# Altium schematic sheet devices.SchDoc
size A4
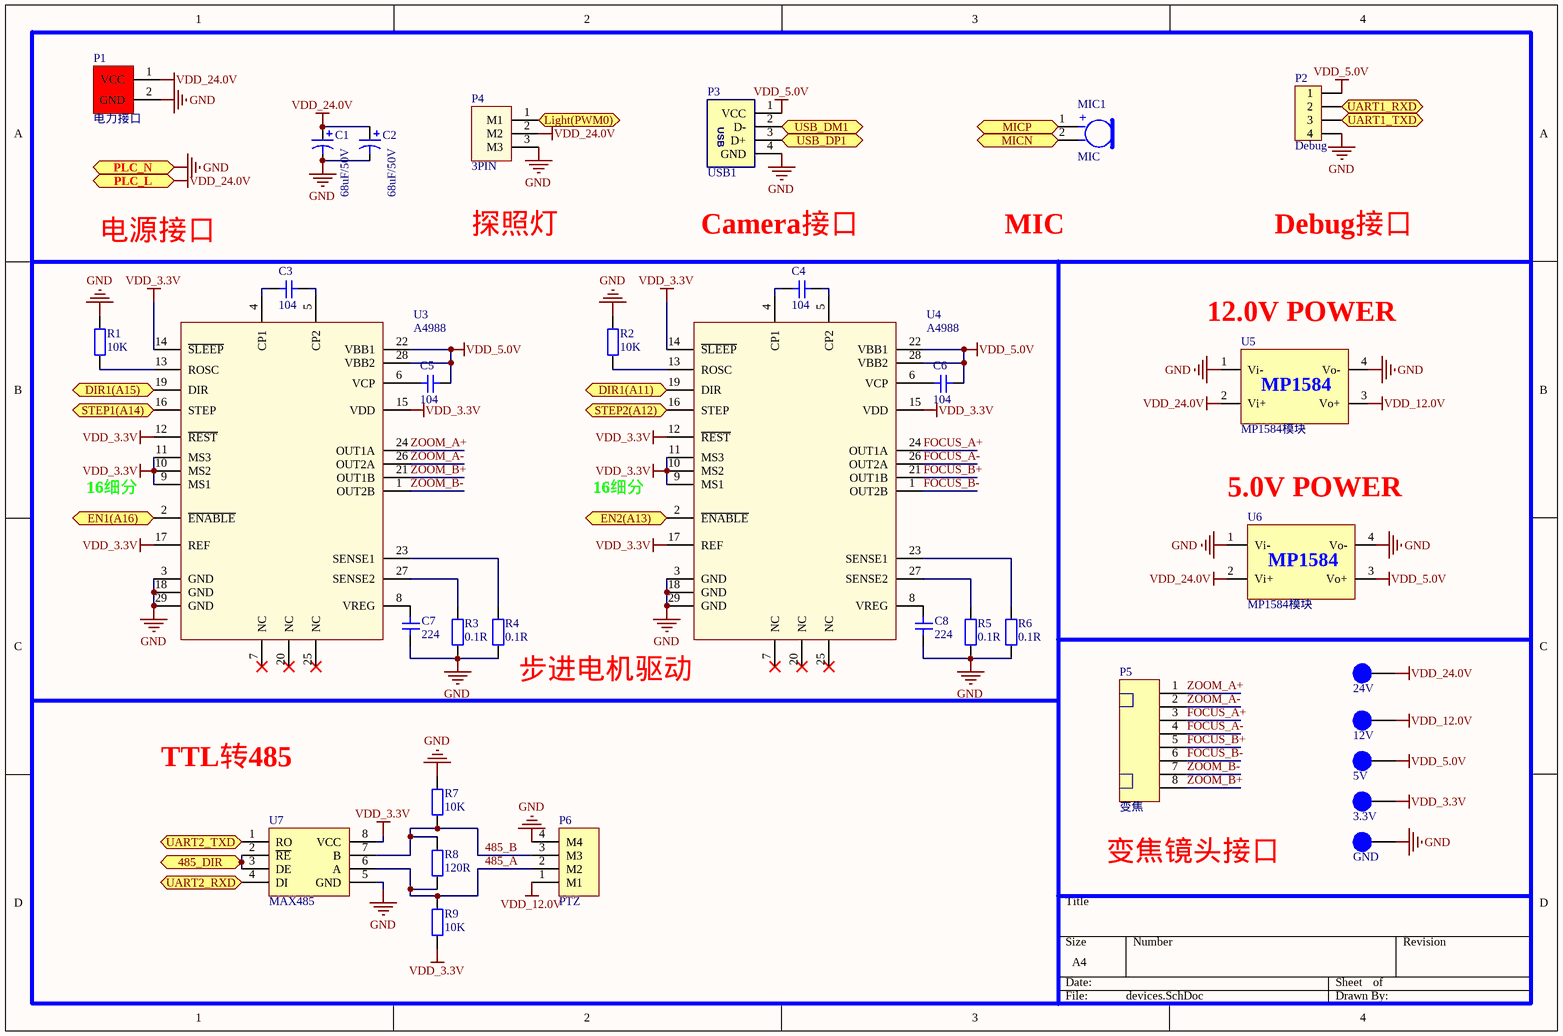
[diagram p0: devices.SchDoc]

## Parts
C1  68uF/50V  [RB.1.2]
C2  68uF/50V  [RB.1.2]
C3  104  [0603C]
C4  104  [0603C]
C5  104  [0603C]
C6  104  [0603C]
C7  224  [0603C]
C8  224  [0603C]
MIC1  MIC  [MIC]
P1  电力接口  [PH2.0WS-2P]
P2  Debug  [MX1.25WS-4PIN]
P3  USB1  [PH2.0WS-4P]
P4  3PIN  [PH2.0WS-3P]
P5  变焦  [MX1.25WS-8P]
P6  PTZ  [PH2.0WS-4P]
R1  10K  [0603R]
R2  10K  [0603R]
R3  0.1R  [0805R]
R4  0.1R  [0805R]
R5  0.1R  [0805R]
R6  0.1R  [0805R]
R7  10K  [0603R]
R8  120R  [0603R]
R9  10K  [0603R]
T1  24V  [PIN 1(贴片)]
T2  12V  [PIN 1(贴片)]
T3  5V  [PIN 1(贴片)]
T4  3.3V  [PIN 1(贴片)]
T5  GND  [PIN 1(贴片)]
U3  A4988  [QFN-28]
U4  A4988  [QFN-28]
U5  MP1584模块  [MP1584电源模块]
U6  MP1584模块  [MP1584电源模块]
U7  MAX485  [SOP-8]

## Ports
485_DIR, DIR1(A11), DIR1(A15), EN1(A16), EN2(A13), Light(PWM0), MICN, MICP, PLC_L, PLC_N, STEP1(A14), STEP2(A12), UART1_RXD, UART1_TXD, UART2_RXD, UART2_TXD, USB_DM1, USB_DP1

## Nets
GND: C1.2 C2.2 C7.1 C8.1 P1.2(GND) P2.4 P3.4(GND) P4.3(M3) P6.4(M4) R1.1 R2.1 R3.1 R4.1 R5.1 R6.1 R7.2 T5.1 U3.3(GND) U3.18(GND) U3.29(GND) U4.3(GND) U4.18(GND) U4.29(GND) U5.1(Vi-) U5.4(Vo-) U6.1(Vi-) U6.4(Vo-) U7.5(GND) ; port PLC_N
VDD_3.3V: R9.1 T4.1 U3.9(MS1) U3.10(MS2) U3.11(MS3) U3.12(~{REST}) U3.14(~{SLEEP}) U3.15(VDD) U3.17(REF) U4.9(MS1) U4.10(MS2) U4.11(MS3) U4.12(~{REST}) U4.14(~{SLEEP}) U4.15(VDD) U4.17(REF) U7.8(VCC)
VDD_5.0V: C5.2 C6.2 P2.1 P3.1(VCC) T3.1 U3.22(VBB1) U3.28(VBB2) U4.22(VBB1) U4.28(VBB2) U6.3(Vo+)
VDD_12.0V: P6.1(M1) T2.1 U5.3(Vo+)
VDD_24.0V: C1.1 C2.1 P1.1(VCC) P4.2(M2) T1.1 U5.2(Vi+) U6.2(Vi+) ; port PLC_L
485_A: P6.2(M2) R8.1 R9.2 U7.6(A)
485_B: P6.3(M3) R7.1 R8.2 U7.7(B)
485_DIR: U7.2(~{RE}) U7.3(DE) ; port 485_DIR
DIR1(A11): U4.19(DIR) ; port DIR1(A11)
DIR1(A15): U3.19(DIR) ; port DIR1(A15)
EN1(A16): U3.2(~{ENABLE}) ; port EN1(A16)
EN2(A13): U4.2(~{ENABLE}) ; port EN2(A13)
FOCUS_A+: P5.3 U4.24(OUT1A)
FOCUS_A-: P5.4 U4.26(OUT2A)
FOCUS_B+: P5.5 U4.21(OUT1B)
FOCUS_B-: P5.6 U4.1(OUT2B)
Light(PWM0): P4.1(M1) ; port Light(PWM0)
MICN: MIC1.2(N) ; port MICN
MICP: MIC1.1(P) ; port MICP
STEP1(A14): U3.16(STEP) ; port STEP1(A14)
STEP2(A12): U4.16(STEP) ; port STEP2(A12)
UART1_RXD: P2.2 ; port UART1_RXD
UART1_TXD: P2.3 ; port UART1_TXD
UART2_RXD: U7.4(DI) ; port UART2_RXD
UART2_TXD: U7.1(RO) ; port UART2_TXD
USB_DM1: P3.2(D-) ; port USB_DM1
USB_DP1: P3.3(D+) ; port USB_DP1
ZOOM_A+: P5.1 U3.24(OUT1A)
ZOOM_A-: P5.2 U3.26(OUT2A)
ZOOM_B+: P5.8 U3.21(OUT1B)
ZOOM_B-: P5.7 U3.1(OUT2B)
NetC3_1: C3.1 U3.4(CP1)
NetC3_2: C3.2 U3.5(CP2)
NetC4_1: C4.1 U4.4(CP1)
NetC4_2: C4.2 U4.5(CP2)
NetC5_1: C5.1 U3.6(VCP)
NetC6_1: C6.1 U4.6(VCP)
NetC7_2: C7.2 U3.8(VREG)
NetC8_2: C8.2 U4.8(VREG)
NetR1_2: R1.2 U3.13(ROSC)
NetR2_2: R2.2 U4.13(ROSC)
NetR3_2: R3.2 U3.27(SENSE2)
NetR4_2: R4.2 U3.23(SENSE1)
NetR5_2: R5.2 U4.27(SENSE2)
NetR6_2: R6.2 U4.23(SENSE1)

Not connected (* = marked no-connect by the designer): U3 7(NC)* 20(NC)* 25(NC)*; U4 7(NC)* 20(NC)* 25(NC)*

## Notes on the sheet
- 电源接口
- 探照灯
- Camera接口
- MIC
- Debug接口
- (near U5) 12.0V POWER
- 16细分
- (near U6) 5.0V POWER
- (near R4) 步进电机驱动
- TTL转485
- (near P5) 变焦镜头接口
- (in symbol MIC) +
- (in symbol MP1584电源模块) MP1584

## Library data of the parts
C1 C2 = Cap3: 直插极性电容
C3-C8 = Cap1: 无极贴片电容
P1 = 电源端子
P2 = Header 4: 排针
P3 = USB
P4 = 接线端子-3PIN
P5 = 接线端子-8PIN
P6 = 接线端子-4PIN: 4PIN
R1-R9 = Res: 电阻
T1-T5 = 测试点
U5 U6 = MP1584电源模块